# EAGLE design FuzzyNavel (EAGLE 6.4)
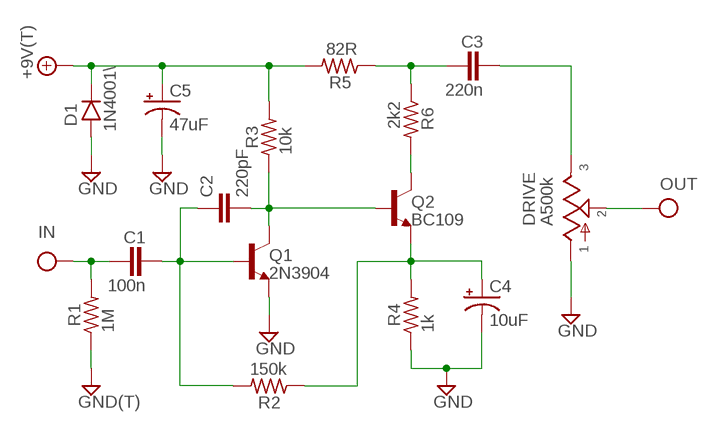
[diagram p0: schematic, sheet 1]

## Parts
+9V  +9V(T)  [SQUARE]
C1  100n  072X0252  [072X025]
C2  220pF  050X030_0501  [050X030_050_1]
C3  220n  072X0352  [072X035]
C4  10uF  0501  [050_020_1]
C5  47uF  0501  [050_020_1]
D1  1N4001\  1N400X.2  [DO41-2]
DRIVE  A500k  POT16MM_PCB_PADS  [16MM_PCB_PADS]
GND  GND(T)  [SQUARE]
IN  IN(T)  [SQUARE]
OUT  OUT(T)  [SQUARE]
Q1  2N3904  [TO92-]
Q2  BC109  2N3904  [TO92-]
R1  1M  6MM.3  [R0207/3]
R2  150k  6MM.3  [R0207/3]
R3  10k  6MM.3  [R0207/3]
R4  1k  6MM.3  [R0207/3]
R5  82R  6MM.3  [R0207/3]
R6  2k2  6MM.3  [R0207/3]

## Nets
+9V: +9V.1(+9V) C5.+ D1.C R3.2 R5.2
GND: C4.- C5.- D1.A DRIVE.1 GND.1(GND) Q1.3(E) R1.1 R4.1
IN: C1.1 IN.1(IN) R1.2
N$1: C2.2 Q1.1(C) Q2.2(B) R3.1
N$2: C1.2 C2.1 Q1.2(B) R2.2
N$3: C4.+ Q2.3(E) R2.1 R4.2
N$5: Q2.1(C) R6.2
N$6: C3.1 R5.1 R6.1
N$7: C3.2 DRIVE.3
OUT: DRIVE.2 OUT.1(OUT)

## Library data of the parts
+9V = mb_supply:+9V(T): +9V Voltage Supply use this to hook up +9v throughout a schematic instead of running wire automatically labels the net "+9v" adds a hookup pad to the circuit board
C1 = mb_caps-box:072X025: 1000pF - 0.47uF WIMA MKP2 63, 100V: 1000pF - 0.015uF; MKS2 50V: 0.33 - 0.47uF; 63V: 1000pF - 0.22uF;
C2 = mb_caps-ceramic:050X030_050: 120 - 150pF Xicon Ceramic Disc 5mm lead spacing
C3 = mb_caps-box:072X035: 0.15 - 1.0uF; WIMA MKP2 63, 100V: 0.047uF; MKS2 50V: 0.68 - 1.0uF; 63V: 0.33 - 0.47uF; 100V: 0.15 - 0.22uF;
C4 C5 = mb_caps-electro:050: 0.22 - 100uF Xicon values at Mouser.com: 10V: 10 - 100uF; 16V: 2.2 - 47uF; 25V: 0.47 - 47uF; 50V: 0.22 - 22uF
D1 = mb_diodes:1N400X: Rectifier Diodes often used in power supply to prevent damage from reverse polarization
DRIVE = mb_pots:POT: Potentiometers the arrow indicates the clockwise motion of th wiper (lug 2) fully counter clockwise there is no resistance between lugs 1 and 2 fully clockwise the resistance between lugs 1 and 2 is the value of the pot
GND = mb_supply:GND(T): Ground use this to hook up ground (GND) throughout a schematic instead of running wire automatically labels the net "GND" adds a hookup pad to the circuit board (you can use several)
IN = mb_supply:IN(T): Input obsolete: use Pad instead and label net shematic input label with circuit board terminal/pad generally used only once on a schematic (because this device labels the net "IN" in the same way as a voltage supply or ground net)
OUT = mb_supply:OUT(T): Output obsolete: use Pad instead and label net output label with circuit board terminal/pad usually appears only once on a schematic
Q1 Q2 = mb_trans:2N3904: NPN Transistor
R1-R6 = mb_resistors:6MM: 6mm Resistors Leads spaced 1-6 holes apart for 0.1" perfboard. Suitable for 1/4 watt resistors.

## Board
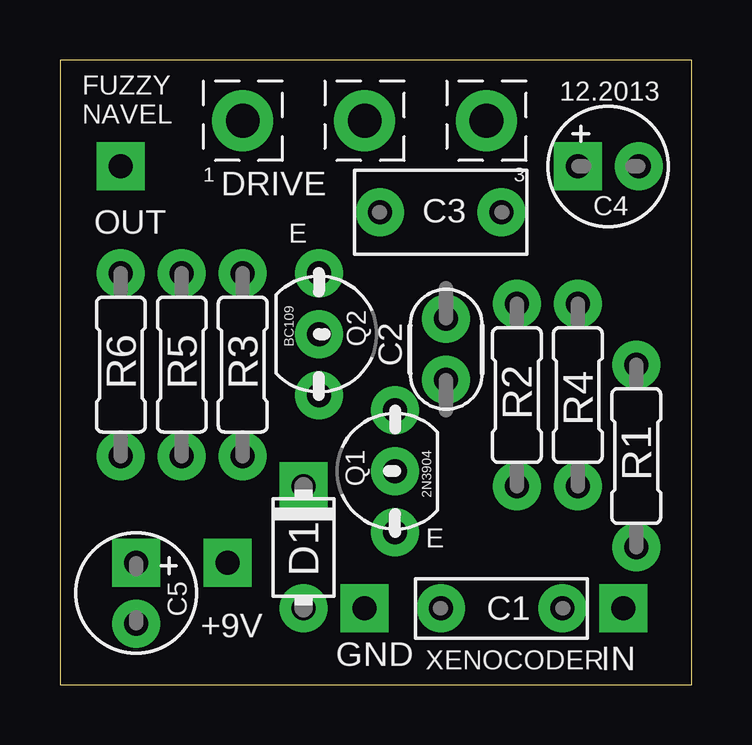
[diagram p1: board, top side]
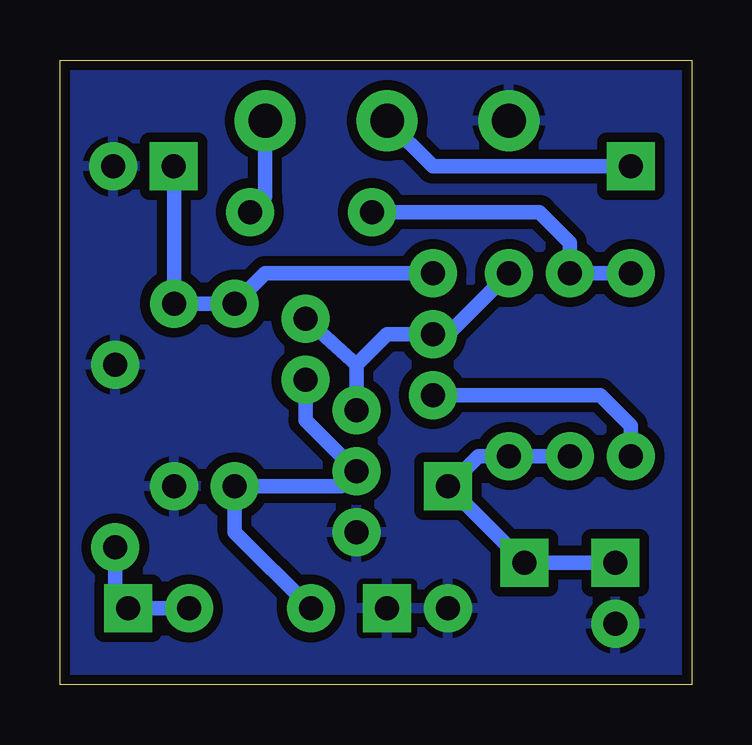
[diagram p2: board, bottom side, seen from below]

Size 26.34 x 26.02 mm. Coordinates in mm from the lower left corner, seen from the top.
Outline: 0,0 26.34,0 26.34,26.02 0,26.02 0,0
Copper layers (1*16): Top 0.0356mm / dielectric 1.5011mm / Bottom 0.0356mm
Design rules "LaenPCBOrder": minimum track width 6mil, minimum drill 13mil, track to track 6mil, track to pad 6mil, pad to pad 6mil, via to via 6mil, smd to smd 6mil, copper to edge 15mil, drill to drill 6mil, minimum pad ring 7mil, minimum via ring 7mil, stop-mask expansion 3mil, vias tented up to drill 0mil, thermal gap 10mil

### Footprints (pad centres in the part's own frame; a part is rotated, then mirrored left to right if it is on the bottom)
SQUARE = drill 1 pad 2 square: 1 0,0
072X025 = drill 1 pad 2: 1 -2.54,0; 2 2.54,0
050X030_050_1 = drill 1 pad 2: 1 -1.27,0; 2 1.27,0
072X035 = drill 1 pad 2: 1 -2.54,0; 2 2.54,0
050_020_1 = drill 1 pad 2 square: + -1.27,0 | drill 1 pad 2: - 1.27,0
DO41-2 = drill 1 pad 2: A 2.54,0 | drill 1 pad 2 square: C -2.54,0
16MM_PCB_PADS = drill 1.4 pad 2.54: 1 5.08,0; 2 0,0; 3 -5.08,0
TO92- = drill 1 pad 2: 1 2.54,0; 2 0,0; 3 -2.54,0
R0207/3 = drill 1 pad 2: 1 -3.81,0; 2 3.81,0

### Placement (x,y rotation side)
+9V  6.98,5.08 0 top
C1  18.42,3.17 180 top
C2  16.1,13.97 90 top
C3  15.87,19.68 0 top
C4  22.86,21.59 0 top
C5  3.18,3.81 270 top
D1  10.16,5.71 270 top
DRIVE  12.7,23.5 180 top
GND  12.7,3.17 0 top
IN  23.5,3.17 0 top
OUT  2.54,21.59 0 top
Q1  13.97,8.89 90 top
Q2  10.79,14.61 270 top
R1  24.03,9.53 270 top
R2  19.05,12.06 270 top
R3  7.62,13.34 270 top
R4  21.59,12.06 90 top
R5  5.08,13.34 270 top
R6  2.54,13.34 270 top

### Tracks (layer width: path | path; a pad name or v marks a point on that pad's centre or on a via)
+9V
  Bottom 0.61: C5.+ +9V.1 D1.C 8.89,9.53 R3.2 R5.2
GND
  pour Bottom (isolate 0.406): 0,26.04 26.37,26.04 26.37,0.05 0,0.05
IN
  Bottom 0.61: C1.1 IN.1 24.03,3.71 R1.2
N$1
  Bottom 0.61: Q1.1 13.97,13.34 | 13.97,13.34 C2.2 | 13.97,13.34 12.7,14.61 Q2.2 10.16,14.61 R3.1
N$2
  Bottom 0.61: C1.2 19.05,6.35 R2.2 14.6,8.26 Q1.2 16.1,11.02 C2.1
N$3
  Bottom 0.61: C4.+ R4.2 R2.1 17.78,17.14 Q2.3
N$5
  Bottom 0.61: R6.2 2.54,10.79 3.81,12.06 Q2.1
N$6
  Bottom 0.61: R6.1 R5.1 5.08,18.41 6.35,19.68 C3.1
N$7
  Bottom 0.61: C3.2 17.78,20.32 DRIVE.3
OUT
  Bottom 0.61: DRIVE.2 10.79,21.59 OUT.1

### Text on the board
tPlace: 12.2013 | FUZZY / NAVEL | E | E | XENOCODER